# Altium project ECU V1.0 B.PrjPcb (part 5 of 14)
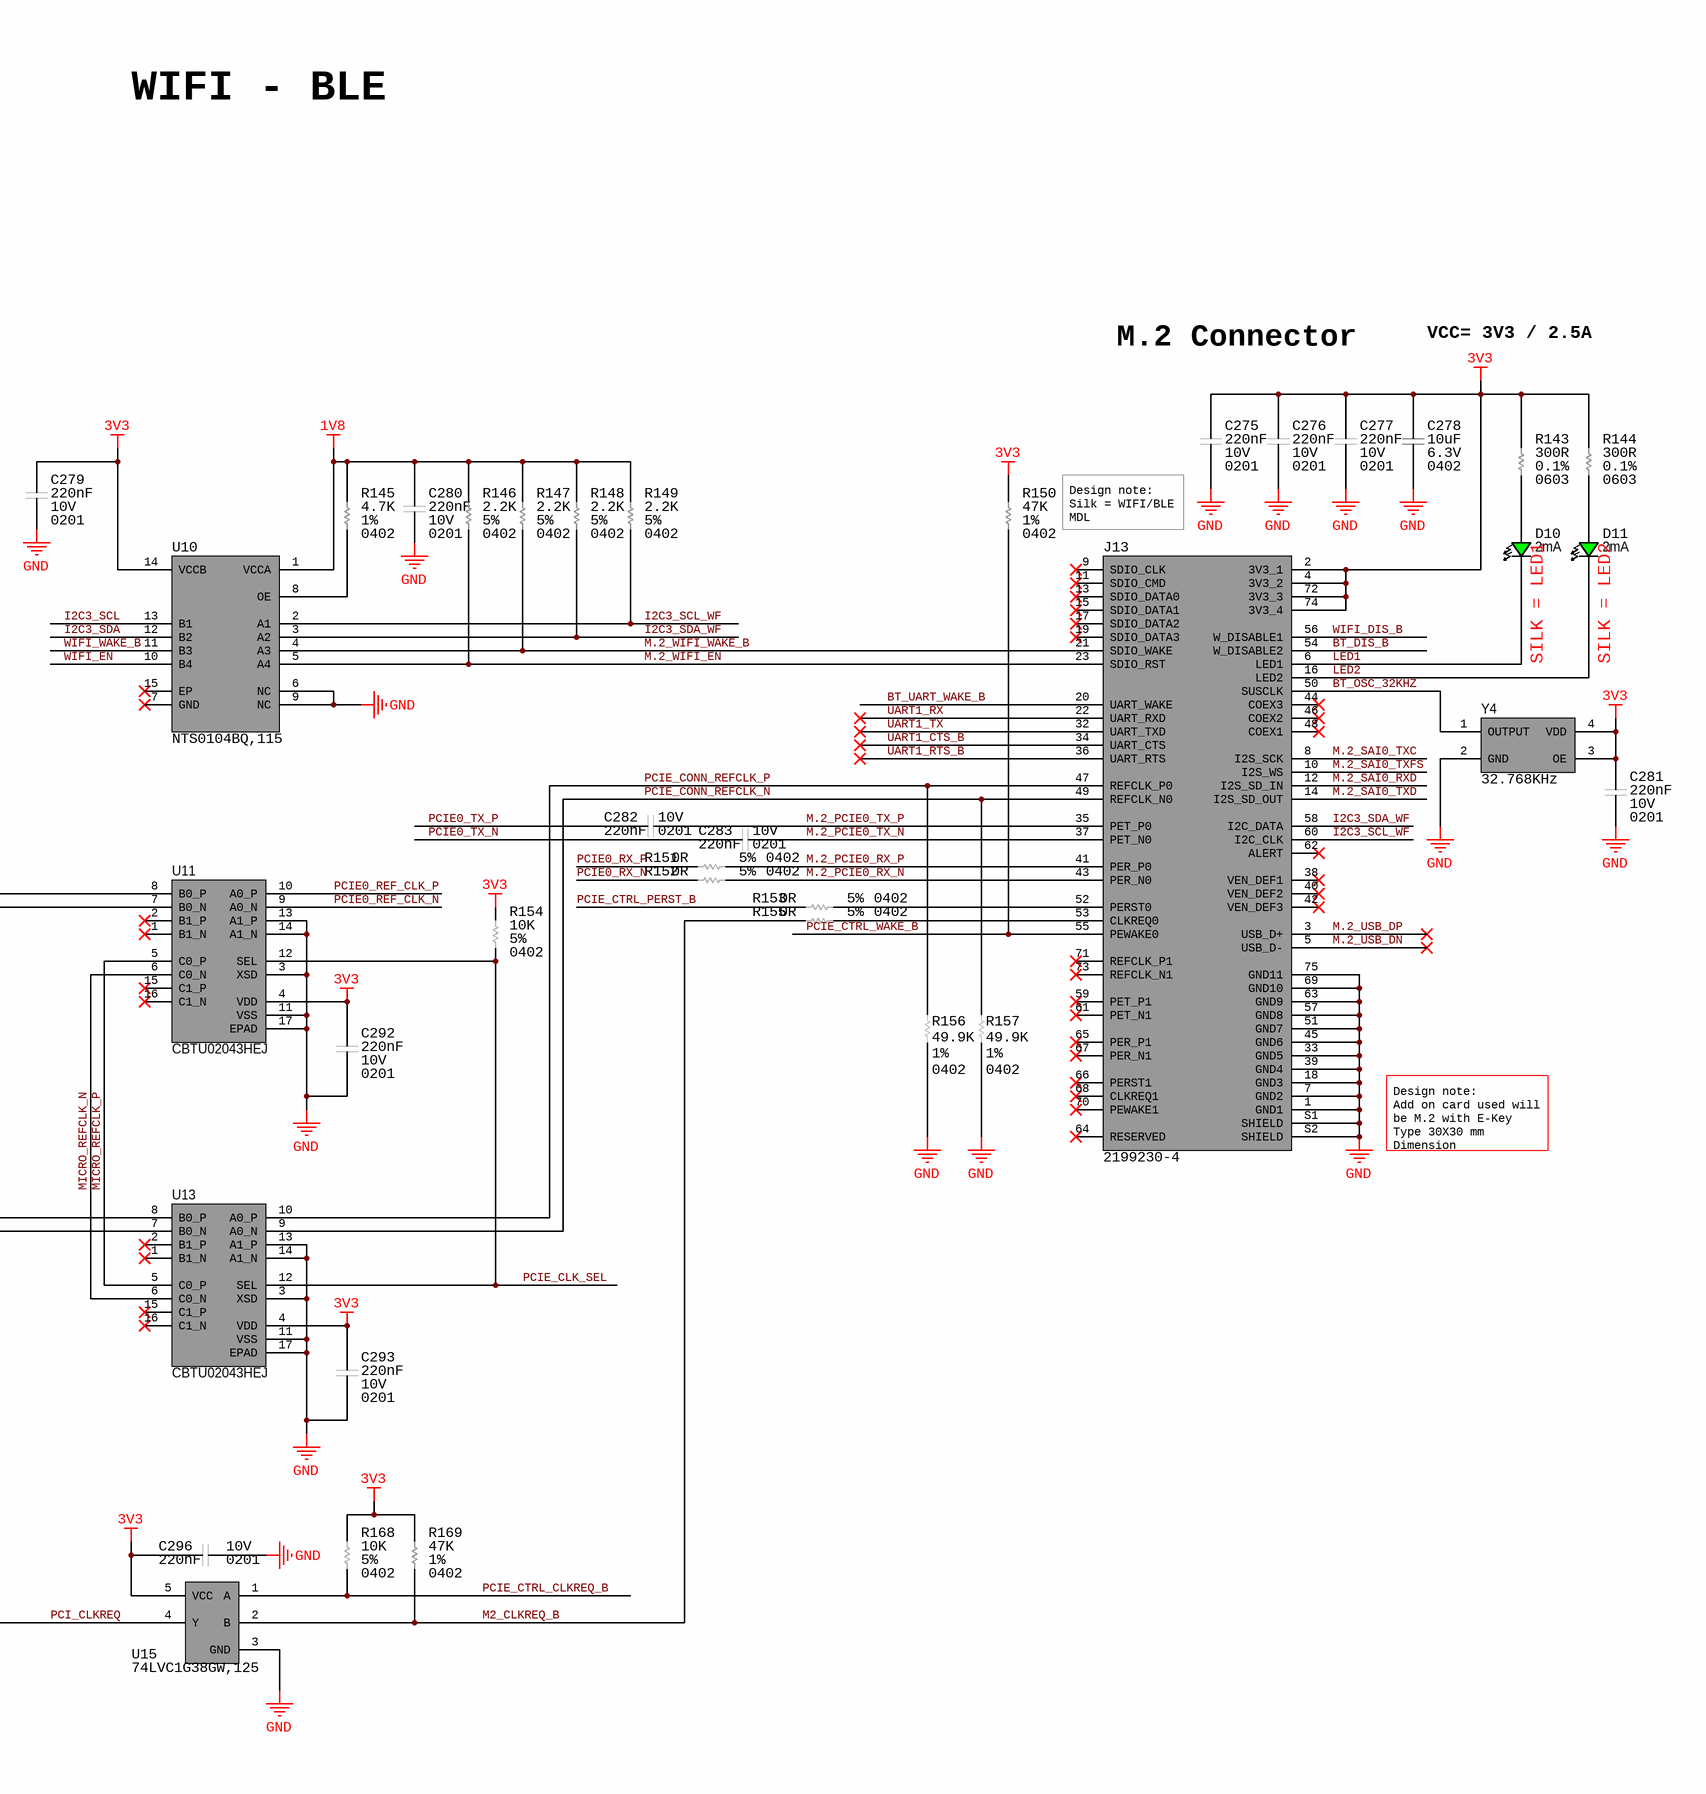
[diagram p16: 19_WIFI_BLE.SchDoc, right]

## Sheet 19_WIFI_BLE.SchDoc (continued)

### Parts
C275  Voltage Rating (DC): 10V  Capacitance: 220nF  Case/Package: 0201  [CAP_0201_CAPC0603X03N]  (hidden comment: LMK063BJ224MP-F)
C276  Voltage Rating (DC): 10V  Capacitance: 220nF  Case/Package: 0201  [CAP_0201_CAPC0603X03N]  (hidden comment: LMK063BJ224MP-F)
C277  Voltage Rating (DC): 10V  Capacitance: 220nF  Case/Package: 0201  [CAP_0201_CAPC0603X03N]  (hidden comment: LMK063BJ224MP-F)
C278  Case/Package: 0402  Capacitance: 10uF  Voltage Rating: 6.3V  [CAP_0402_CAPC1005X05N]  (hidden comment: CL05A106MQ5NUNC)
C279  Voltage Rating (DC): 10V  Capacitance: 220nF  Case/Package: 0201  [CAP_0201_CAPC0603X03N]  (hidden comment: LMK063BJ224MP-F)
C280  Voltage Rating (DC): 10V  Capacitance: 220nF  Case/Package: 0201  [CAP_0201_CAPC0603X03N]  (hidden comment: LMK063BJ224MP-F)
C281  Voltage Rating (DC): 10V  Capacitance: 220nF  Case/Package: 0201  [CAP_0201_CAPC0603X03N]  (hidden comment: LMK063BJ224MP-F)
C282  Voltage Rating (DC): 10V  Capacitance: 220nF  Case/Package: 0201  [CAP_0201_CAPC0603X03N]  (hidden comment: LMK063BJ224MP-F)
C283  Voltage Rating (DC): 10V  Capacitance: 220nF  Case/Package: 0201  [CAP_0201_CAPC0603X03N]  (hidden comment: LMK063BJ224MP-F)
C284  Voltage Rating (DC): 6.3V  Capacitance: 1uF  Case/Package: 0201  [CAP_0201_CAPC0603X03N]  (hidden comment: 02016D105MAT2A)
C285  Voltage Rating: 16V  Capacitance: 100nF  Case/Package: 0201  [CAP_0201_CAPC0603X03N]  (hidden comment: GRM033C71C104KE14D)
C286  Voltage Rating (DC): 6.3V  Capacitance: 1uF  Case/Package: 0201  [CAP_0201_CAPC0603X03N]  (hidden comment: 02016D105MAT2A)
C287  Voltage Rating: 16V  Capacitance: 100nF  Case/Package: 0201  [CAP_0201_CAPC0603X03N]  (hidden comment: GRM033C71C104KE14D)
C288  Voltage Rating: 16V  Capacitance: 100nF  Case/Package: 0201  [CAP_0201_CAPC0603X03N]  (hidden comment: GRM033C71C104KE14D)
C289  Voltage Rating (DC): 6.3V  Capacitance: 1uF  Case/Package: 0201  [CAP_0201_CAPC0603X03N]  (hidden comment: 02016D105MAT2A)
C290  Voltage Rating: 16V  Capacitance: 100nF  Case/Package: 0201  [CAP_0201_CAPC0603X03N]  (hidden comment: GRM033C71C104KE14D)
C291  Voltage Rating: 16V  Capacitance: 100nF  Case/Package: 0201  [CAP_0201_CAPC0603X03N]  (hidden comment: GRM033C71C104KE14D)
C292  Voltage Rating (DC): 10V  Capacitance: 220nF  Case/Package: 0201  [CAP_0201_CAPC0603X03N]  (hidden comment: LMK063BJ224MP-F)
C293  Voltage Rating (DC): 10V  Capacitance: 220nF  Case/Package: 0201  [CAP_0201_CAPC0603X03N]  (hidden comment: LMK063BJ224MP-F)
C294  Capacitance: 6.8pF  Voltage Rating: 50V  Case/Package: 0201  [CAP_0201_CAPC0603X03N]  (hidden comment: GRM0335C1H6R8BA01D)
C295  Capacitance: 6.8pF  Voltage Rating: 50V  Case/Package: 0201  [CAP_0201_CAPC0603X03N]  (hidden comment: GRM0335C1H6R8BA01D)
C296  Voltage Rating (DC): 10V  Capacitance: 220nF  Case/Package: 0201  [CAP_0201_CAPC0603X03N]  (hidden comment: LMK063BJ224MP-F)
C297  Voltage Rating (DC): 10V  Capacitance: 220nF  Case/Package: 0201  [CAP_0201_CAPC0603X03N]  (hidden comment: LMK063BJ224MP-F)
C298  Voltage Rating (DC): 10V  Capacitance: 220nF  Case/Package: 0201  [CAP_0201_CAPC0603X03N]  (hidden comment: LMK063BJ224MP-F)
C299  Voltage Rating (DC): 10V  Capacitance: 220nF  Case/Package: 0201  [CAP_0201_CAPC0603X03N]  (hidden comment: LMK063BJ224MP-F)
D10  Test Current: 2mA  [LED_GREEN_APDA3020LZGCK]  (hidden comment: APDA3020LZGCK)
D11  Test Current: 2mA  [LED_GREEN_APDA3020LZGCK]  (hidden comment: APDA3020LZGCK)
FB4  Impedance: 600R  Case Code (Imperial): 0603  [IND_0603_INDC1608X08N]  (hidden comment: 742792653)
FB5  Impedance: 600R  Case Code (Imperial): 0603  [IND_0603_INDC1608X08N]  (hidden comment: 742792653)
J13  2199230-4  [TE_21992304]
R136  Case Code (Imperial): 0402  Tolerance: 5%  Resistance: 0R  [RES_0402_RESC1005X04N]  (hidden comment: ERJ-2GE0R00X)
R137  Case Code (Imperial): 0402  Tolerance: 5%  Resistance: 0R  [RES_0402_RESC1005X04N]  (hidden comment: ERJ-2GE0R00X)
R138  Case Code (Imperial): 0402  Tolerance: 5%  Resistance: 0R  [RES_0402_RESC1005X04N]  (hidden comment: ERJ-2GE0R00X)
R139  Case Code (Imperial): 0402  Tolerance: 5%  Resistance: 0R  [RES_0402_RESC1005X04N]  (hidden comment: ERJ-2GE0R00X)
R140  Case Code (Imperial): 0402  Tolerance: 5%  Resistance: 0R  [RES_0402_RESC1005X04N]  (hidden comment: ERJ-2GE0R00X)
R141  Case Code (Imperial): 0402  Tolerance: 5%  Resistance: 0R  [RES_0402_RESC1005X04N]  (hidden comment: ERJ-2GE0R00X)
R142  Case Code (Imperial): 0402  Tolerance: 5%  Resistance: 0R  [RES_0402_RESC1005X04N]  (hidden comment: ERJ-2GE0R00X)
R143  Case Code (Imperial): 0603  Tolerance: 0.1%  Resistance: 300R  [RES_0603_RESC1608X04N]  (hidden comment: RT0603BRD07300RL)
R144  Case Code (Imperial): 0603  Tolerance: 0.1%  Resistance: 300R  [RES_0603_RESC1608X04N]  (hidden comment: RT0603BRD07300RL)
R145  Tolerance: 1%  Case Code (Imperial): 0402  Resistance: 4.7K  [RES_0402_RESC1005X04N]  (hidden comment: ERJ-2RKF4701X)
R146  Tolerance: 5%  Resistance: 2.2K  Case/Package: 0402  [RES_0402_RESC1005X04N]  (hidden comment: RC0402JR-072K2L)
R147  Tolerance: 5%  Resistance: 2.2K  Case/Package: 0402  [RES_0402_RESC1005X04N]  (hidden comment: RC0402JR-072K2L)
R148  Tolerance: 5%  Resistance: 2.2K  Case/Package: 0402  [RES_0402_RESC1005X04N]  (hidden comment: RC0402JR-072K2L)
R149  Tolerance: 5%  Resistance: 2.2K  Case/Package: 0402  [RES_0402_RESC1005X04N]  (hidden comment: RC0402JR-072K2L)
R150  Tolerance: 1%  Resistance: 47K  Case/Package: 0402  [RES_0402_RESC1005X04N]  (hidden comment: ERJ-2RKF4702X)
R151  Case Code (Imperial): 0402  Tolerance: 5%  Resistance: 0R  [RES_0402_RESC1005X04N]  (hidden comment: ERJ-2GE0R00X)
R152  Case Code (Imperial): 0402  Tolerance: 5%  Resistance: 0R  [RES_0402_RESC1005X04N]  (hidden comment: ERJ-2GE0R00X)
R153  Case Code (Imperial): 0402  Tolerance: 5%  Resistance: 0R  [RES_0402_RESC1005X04N]  (hidden comment: ERJ-2GE0R00X)
R154  Tolerance: 5%  Resistance: 10K  Case/Package: 0402  [RES_0402_RESC1005X04N]  (hidden comment: ERJ-2GEJ103X)
R155  Case Code (Imperial): 0402  Tolerance: 5%  Resistance: 0R  [RES_0402_RESC1005X04N]  (hidden comment: ERJ-2GE0R00X)
R156  Resistance: 49.9K  Tolerance: 1%  Case/Package: 0402  [RES_0402_RESC1005X04N]  (hidden comment: CRCW040249K9FKED)
R157  Resistance: 49.9K  Tolerance: 1%  Case/Package: 0402  [RES_0402_RESC1005X04N]  (hidden comment: CRCW040249K9FKED)
R158  Case Code (Imperial): 0402  Tolerance: 5%  Resistance: 0R  [RES_0402_RESC1005X04N]  (hidden comment: ERJ-2GE0R00X)
R159  Case Code (Imperial): 0402  Tolerance: 5%  Resistance: 0R  [RES_0402_RESC1005X04N]  (hidden comment: ERJ-2GE0R00X)
R160  Case Code (Imperial): 0402  Tolerance: 5%  Resistance: 0R  [RES_0402_RESC1005X04N]  (hidden comment: ERJ-2GE0R00X)
R161  Case Code (Imperial): 0402  Tolerance: 5%  Resistance: 0R  [RES_0402_RESC1005X04N]  (hidden comment: ERJ-2GE0R00X)
R162  Case Code (Imperial): 0402  Tolerance: 5%  Resistance: 0R  [RES_0402_RESC1005X04N]  (hidden comment: ERJ-2GE0R00X)
R163  Case Code (Imperial): 0402  Tolerance: 5%  Resistance: 0R  [RES_0402_RESC1005X04N]  (hidden comment: ERJ-2GE0R00X)
R164  Case Code (Imperial): 0402  Tolerance: 5%  Resistance: 0R  [RES_0402_RESC1005X04N]  (hidden comment: ERJ-2GE0R00X)
R165  Case Code (Imperial): 0402  Tolerance: 5%  Resistance: 0R  [RES_0402_RESC1005X04N]  (hidden comment: ERJ-2GE0R00X)
R166  Tolerance: 5%  Resistance: 10K  Case/Package: 0402  [RES_0402_RESC1005X04N]  (hidden comment: ERJ-2GEJ103X)
R167  Case Code (Imperial): 0402  Tolerance: 5%  Resistance: 0R  [RES_0402_RESC1005X04N]  (hidden comment: ERJ-2GE0R00X)
R168  Tolerance: 5%  Resistance: 10K  Case/Package: 0402  [RES_0402_RESC1005X04N]  (hidden comment: ERJ-2GEJ103X)
R169  Tolerance: 1%  Resistance: 47K  Case/Package: 0402  [RES_0402_RESC1005X04N]  (hidden comment: ERJ-2RKF4702X)
R170  Case Code (Imperial): 0402  Tolerance: 5%  Resistance: 0R  [RES_0402_RESC1005X04N]  (hidden comment: ERJ-2GE0R00X)
TP45  NO COMPONENT  [TP_PAD_0.5MM_SMD_ROUND]  (value not drawn)  (no BOM)
TP46  NO COMPONENT  [TP_PAD_0.5MM_SMD_ROUND]  (value not drawn)  (no BOM)
U10  NTS0104BQ,115  [QFN50P300X250X100-15N]
U11  CBTU02043HEJ  [IC_SW_TYPEC_CBTU02044HEJ]
U12  9FGV0241AKILF  [QFN50P400X400X100-25N-D]
U13  CBTU02043HEJ  [IC_SW_TYPEC_CBTU02044HEJ]
U14  74LVC1G04GW,125  [SOT65P210X110-5N]
U15  74LVC1G38GW,125  [SOT65P212X110-5N]
U16  SN74AVC1T45DBVR  [SOT95P280X145-6N]
Y4  Frequency: 32.768KHz  [CRYSTAL_32.768KHZ_ASH7KW32768kHzLT]  (hidden comment: ASH7KW-32.768kHz-L-T)
Y5  ECS-250-18-33-JTM-TR  Frequency: 25MHz  [CRYSTAL_ECS-250-18-33-JTM-TR]

### Ports
BT_DIS_B, BT_UART_WAKE_B, I2C3 (harness I2C3), PCIE0 (harness PCIE0), PCIE_CLK_SEL, PCIE_CTRL0 (harness PCIE_CTRL0), SPI0 (harness SPI0), SS_CNTRL, UART1 (harness UART1), WIFI_DIS_B, WIFI_EN, WIFI_WAKE_B

### Harnesses
UART1: UART1_TX, UART1_RX, UART1_RTS_B, UART1_CTS_B
PCIE0: PCIE0_TX_P, PCIE0_TX_N, PCIE0_RX_P, PCIE0_RX_N, PCIE_REF_CLK_P, PCIE_REF_CLK_N
PCIE_CTRL0: PCIE_CTRL_CLKREQ_B, PCIE_CTRL_WAKE_B, PCIE_CTRL_PERST_B
SPI0: SPI0_CS0, SPI0_CS1, SPI0_SCK, SPI0_SDI, SPI0_SDO
I2C3: I2C3_SDA, I2C3_SCL

### Nets
1V8: C280.2 C284.2 C285.2 C298.1 FB4.2 FB5.1 R145.2 R146.2 R147.2 R148.2 R149.2 R166.2 U10.1(VCCA) U12.7(VDDDIG1.8) U16.1(VCCA)
3V3: C275.2 C276.2 C277.2 C278.2 C279.2 C281.2 C292.2 C293.2 C296.1 C297.1 C299.1 J13.2(3V3_1) J13.4(3V3_2) J13.72(3V3_3) J13.74(3V3_4) R143.2 R144.2 R150.2 R154.1 R168.2 R169.2 U10.14(VCCB) U11.4(VDD) U13.4(VDD) U14.5(VCC) U15.5(VCC) U16.6(VCCB) Y4.3(OE) Y4.4(VDD)
GND: C275.1 C276.1 C277.1 C278.1 C279.1 C280.1 C281.1 C284.1 C285.1 C286.1 C287.1 C288.1 C289.1 C290.1 C291.1 C292.1 C293.1 C294.1 C295.1 C296.2 C297.2 C298.2 C299.2 J13.1(GND1) J13.7(GND2) J13.18(GND3) J13.33(GND5) J13.39(GND4) J13.45(GND6) J13.51(GND7) J13.57(GND8) J13.63(GND9) J13.69(GND10) J13.75(GND11) J13.S1(SHIELD) J13.S2(SHIELD) R156.1 R157.1 R163.1 R164.1 R165.1 R170.2 U10.6(NC) U10.9(NC) U11.3(XSD) U11.11(VSS) U11.13(A1_P) U11.14(A1_N) U11.17(EPAD) U12.5(GNDREF) U12.6(GNDDIG) U12.10(GND_1) U12.15(GNDA) U12.21(GND_2) U12.24(GNDXTAL) U12.25(GND_3) U13.3(XSD) U13.11(VSS) U13.13(A1_P) U13.14(A1_N) U13.17(EPAD) U14.1(NC) U14.3(GND) U15.3(GND) U16.2(GND) Y4.2(GND) Y5.2 Y5.4
BT_DIS_B: J13.54(W_DISABLE2) ; port BT_DIS_B
BT_OSC_32KHZ: J13.50(SUSCLK) Y4.1(OUTPUT)
BT_UART_WAKE_B: J13.20(UART_WAKE) ; port BT_UART_WAKE_B
I2C1_SCL: U12.8(SCLK_3.3)
I2C1_SDA: U12.9(SDATA_3.3)
I2C3_SCL: U10.13(B1) ; port I2C3.I2C3_SCL
I2C3_SCL_WF: J13.60(I2C_CLK) R149.1 U10.2(A1)
I2C3_SDA: U10.12(B2) ; port I2C3.I2C3_SDA
I2C3_SDA_WF: J13.58(I2C_DATA) R148.1 U10.3(A2)
LED1: D10.1(C) J13.6(LED1)
LED2: D11.1(C) J13.16(LED2)
M2_CLKREQ_B: R155.1 R169.1 U15.2(B)
M.2_PCIE0_RX_N: J13.43(PER_N0) R152.2
M.2_PCIE0_RX_P: J13.41(PER_P0) R151.2
M.2_PCIE0_TX_N: C283.1 J13.37(PET_N0)
M.2_PCIE0_TX_P: C282.1 J13.35(PET_P0)
M.2_SAI0_RXC: R139.2 TP45.1
M.2_SAI0_RXD: J13.12(I2S_SD_IN) R138.2
M.2_SAI0_TXC: J13.8(I2S_SCK) R140.2
M.2_SAI0_TXD: J13.14(I2S_SD_OUT) R141.2
M.2_SAI0_TXFS: J13.10(I2S_WS) R142.2
M.2_USB_DN: J13.5(USB_D-)
M.2_USB_DP: J13.3(USB_D+)
M.2_WIFI_EN: J13.23(SDIO_RST) R146.1 U10.5(A4)
M.2_WIFI_WAKE_B: J13.21(SDIO_WAKE) R147.1 U10.4(A3)
MICRO_REFCLK_N: U11.6(C0_N) U13.6(C0_N)
MICRO_REFCLK_P: U11.5(C0_P) U13.5(C0_P)
PCI_CLKREQ: R163.2 R166.1 R167.1 R167.2 U12.22(CKPWRGD_PD#) U15.4(Y)
PCI_XTAL_X1: C294.2 U12.1(X1_25) Y5.1(IN)
PCI_XTAL_X2: R160.2 U12.2(X2)
PCIE0_REF_CLK_N: R137.2 U11.9(A0_N)
PCIE0_REF_CLK_P: R136.2 U11.10(A0_P)
PCIE0_RX_N: R152.1 ; port PCIE0.PCIE0_RX_N
PCIE0_RX_P: R151.1 ; port PCIE0.PCIE0_RX_P
PCIE0_TX_N: C283.2 ; port PCIE0.PCIE0_TX_N
PCIE0_TX_P: C282.2 ; port PCIE0.PCIE0_TX_P
PCIE_CLK_SEL: R154.2 U11.12(SEL) U13.12(SEL) ; port PCIE_CLK_SEL  [project net PCI_CLK_SEL]
PCIE_CONN_REFCLK_N: J13.49(REFCLK_N0) R157.2 U13.9(A0_N)
PCIE_CONN_REFCLK_P: J13.47(REFCLK_P0) R156.2 U13.10(A0_P)
PCIE_CTRL_CLKREQ_B: R168.1 U15.1(A) ; port PCIE_CTRL0.PCIE_CTRL_CLKREQ_B
PCIE_CTRL_PERST_B: R153.1 ; port PCIE_CTRL0.PCIE_CTRL_PERST_B
PCIE_CTRL_WAKE_B: J13.55(PEWAKE0) R150.1 ; port PCIE_CTRL0.PCIE_CTRL_WAKE_B
PCIE_REF_CLK_N: R137.1 ; port PCIE0.PCIE_REF_CLK_N
PCIE_REF_CLK_P: R136.1 ; port PCIE0.PCIE_REF_CLK_P
REFCLK1_N: R159.2 U11.7(B0_N)
REFCLK1_P: R158.2 U11.8(B0_P)
REFCLK2_N: R162.2 U13.7(B0_N)
REFCLK2_P: R161.2 U13.8(B0_P)
SPI0_CS0: R138.1 ; port SPI0.SPI0_CS0
SPI0_CS1: R139.1 ; port SPI0.SPI0_CS1
SPI0_SCK: R140.1 ; port SPI0.SPI0_SCK
SPI0_SDI: R141.1 ; port SPI0.SPI0_SDI
SPI0_SDO: R142.1 ; port SPI0.SPI0_SDO
SS_CNTRL: U14.2(A) ; port SS_CNTRL
SS_CNTRL_B: U14.4(Y) U16.4(B)
SS_EN_TRI: U12.23(SS_EN_TRI) U16.3(A)
UART1_CTS_B: J13.34(UART_CTS) ; port UART1.UART1_CTS_B
UART1_RTS_B: J13.36(UART_RTS) ; port UART1.UART1_RTS_B
UART1_RX: J13.22(UART_RXD) ; port UART1.UART1_RX
UART1_TX: J13.32(UART_TXD) ; port UART1.UART1_TX
WIFI_DIS_B: J13.56(W_DISABLE1) ; port WIFI_DIS_B
WIFI_EN: U10.10(B4) ; port WIFI_EN
WIFI_WAKE_B: U10.11(B3) ; port WIFI_WAKE_B
XTAL2: C295.2 R160.1 Y5.3(OUT)
NetC286_2: C286.2 C287.2 C288.2 FB4.1 U12.3(VDDXTAL1.8) U12.16(VDDA1.8)
NetC289_2: C289.2 C290.2 C291.2 FB5.2 U12.11(VDD1.8_1) U12.20(VDD1.8_2)
NetD10_2: D10.2(A) R143.1
NetD11_2: D11.2(A) R144.1
NetJ13_52: J13.52(PERST0) R153.2
NetJ13_53: J13.53(CLKREQ0) R155.2
NetR145_1: R145.1 U10.8(OE)
NetR158_1: R158.1 U12.17(DIF1)
NetR159_1: R159.1 U12.18(DIF1#)
NetR161_1: R161.1 U12.13(DIF0)
NetR162_1: R162.1 U12.14(DIF0#)
NetR164_2: R164.2 U12.12(OE0#)
NetR165_2: R165.2 U12.19(OE1#)
NetR170_1: R170.1 U16.5(DIR)
NetTP46_1: TP46.1 U12.4(SADR/REF1.8)

Not connected (* = marked no-connect by the designer): J13 9(SDIO_CLK)* 11(SDIO_CMD)* 13(SDIO_DATA0)* 15(SDIO_DATA1)* 17(SDIO_DATA2)* 19(SDIO_DATA3)* 38(VEN_DEF1)* 40(VEN_DEF2)* 42(VEN_DEF3)* 44(COEX3)* 46(COEX2)* 48(COEX1)* 59(PET_P1)* 61(PET_N1)* 62(ALERT)* 64(RESERVED)* 65(PER_P1)* 66(PERST1)* 67(PER_N1)* 68(CLKREQ1)* 70(PEWAKE1)* 71(REFCLK_P1)* 73(REFCLK_N1)*; U10 7(GND)* 15(EP)*; U11 1(B1_N)* 2(B1_P)* 15(C1_P)* 16(C1_N)*; U13 1(B1_N)* 2(B1_P)* 15(C1_P)* 16(C1_N)*

### Notes on the sheet
- WIFI - BLE
- M.2 Connector
- VCC= 3V3 / 2.5A
- GPIO's
- Design note:
  Silk = WIFI/BLE MDL
- (near D10) SILK = LED1
- (near D11) SILK = LED2
- PCIe Clock Generator
- VDDA = 1V8 / 2.5A
- (near C284) VDD= 1V8 / 2.5A
- Design note:
  Add on card used will be M.2 with E-Key Type 30X30 mm Dimension
- Design note:
  To place resistors very close IC pins
- PCB Des :
- Approv By :
- Project Title :
- Sheet Title :
- Date :
- Page :
- PCB Version :
- PCB Revision :
- Size :
- A2